# EAGLE board axiom_beta_main_board_v0.37_r1.2 (EAGLE 7.7.0), part 1 of 4
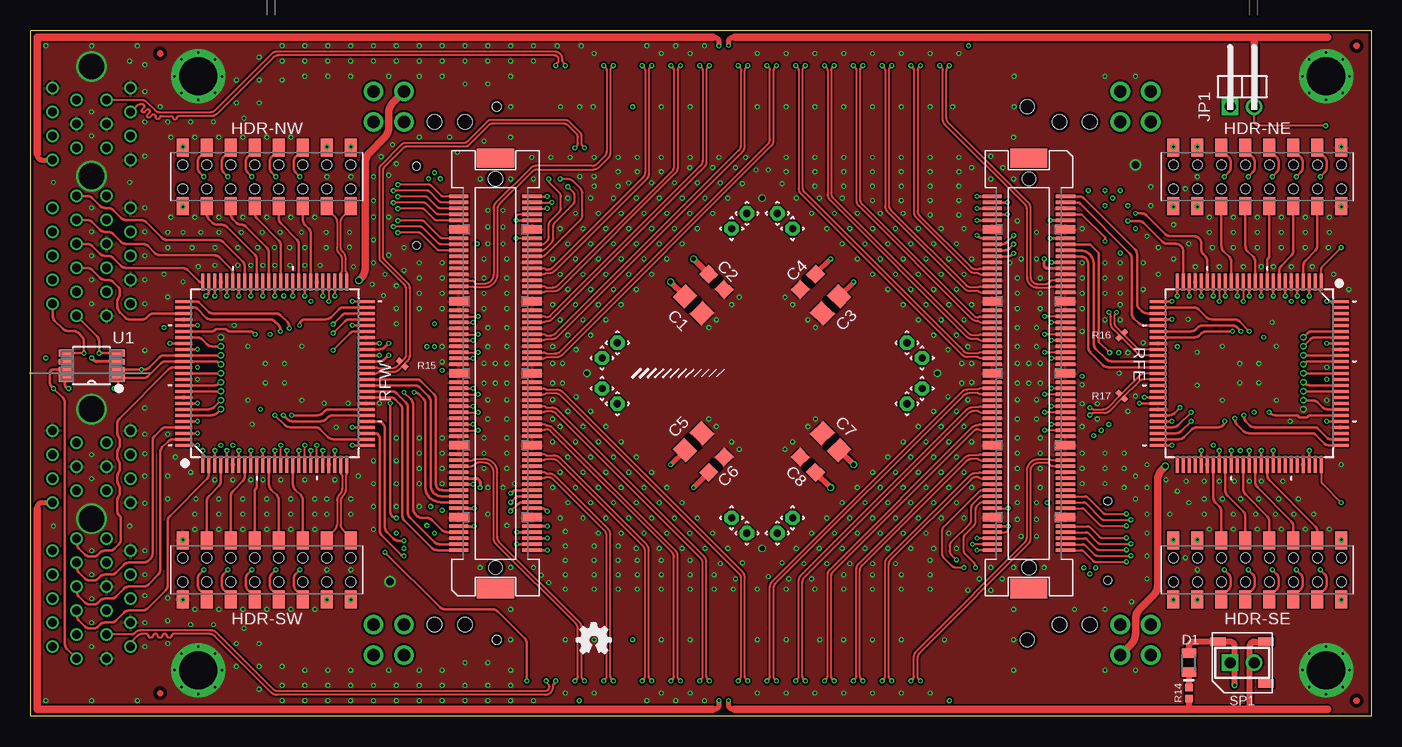
[diagram p6: board, top side]
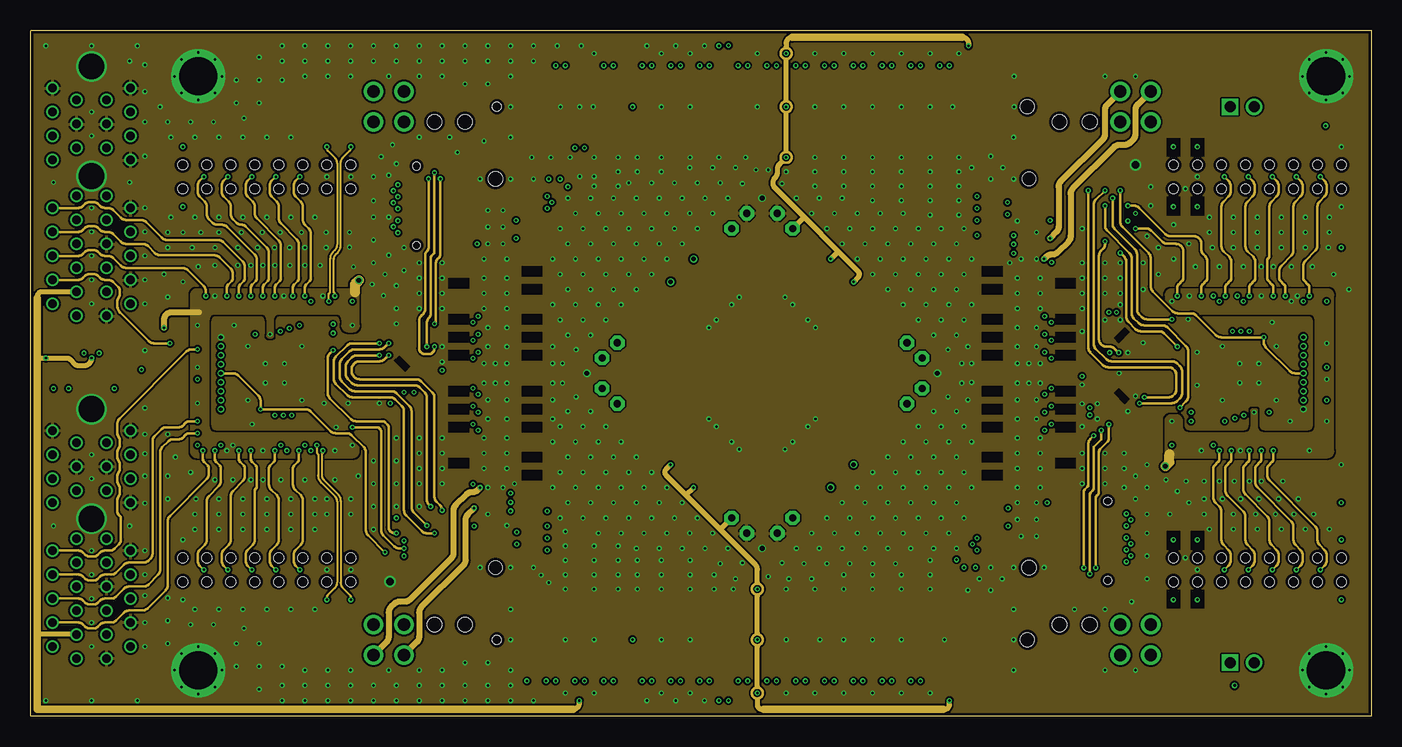
[diagram p7: board, inner layer Route2]
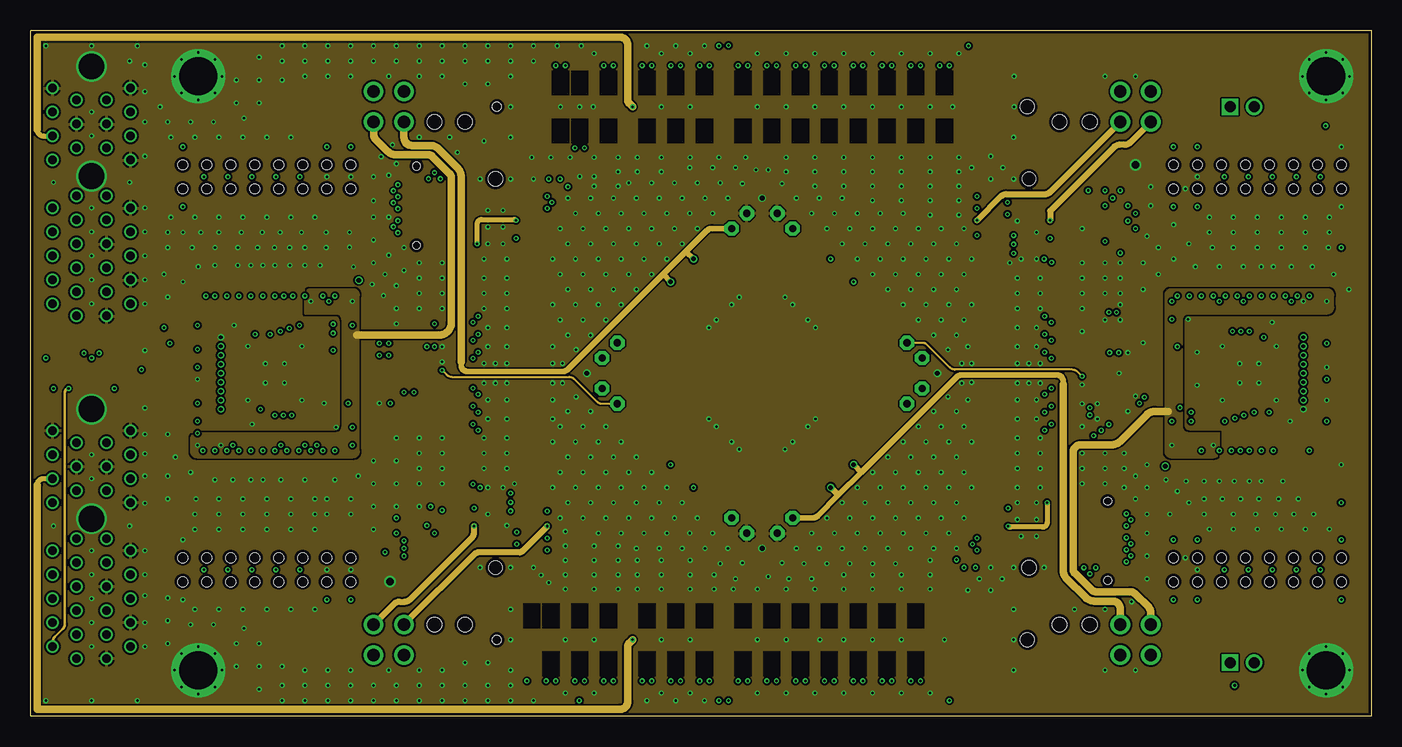
[diagram p8: board, inner layer Route15]
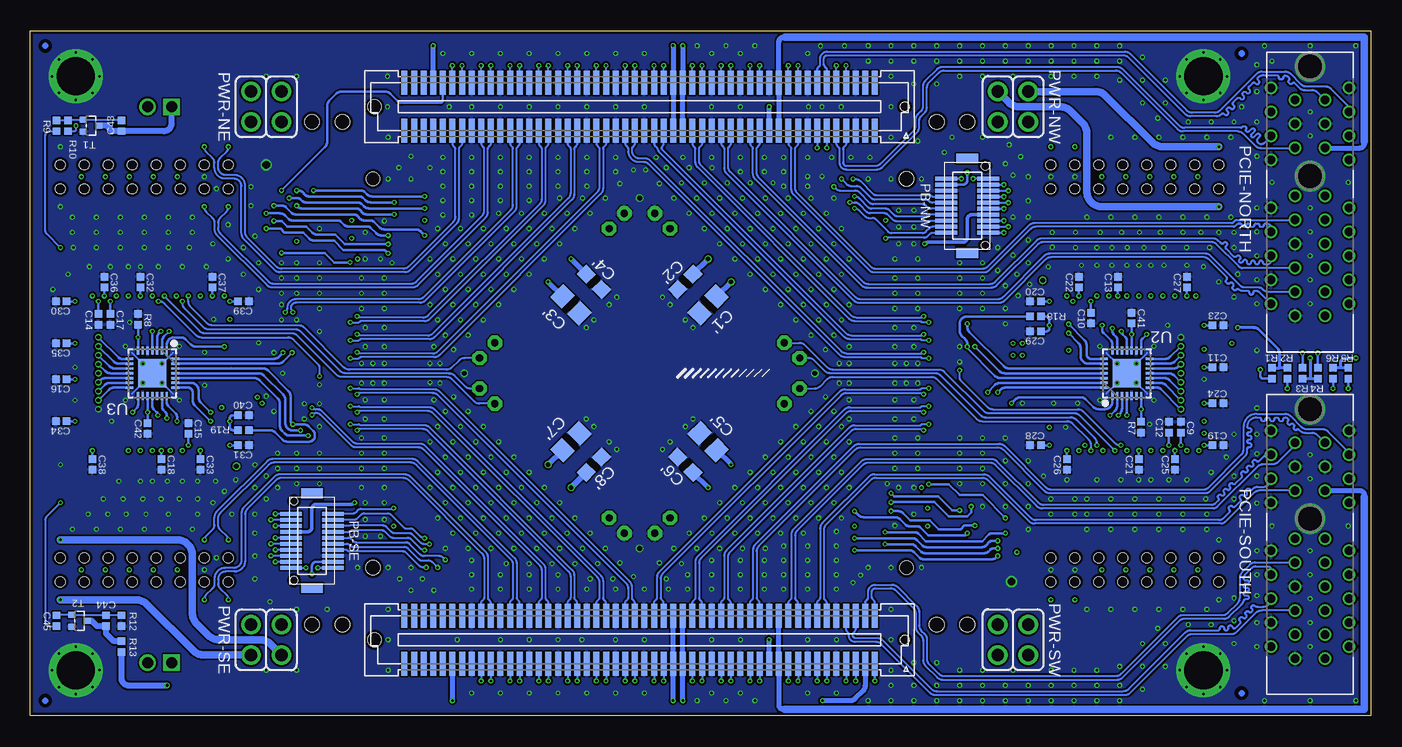
[diagram p9: board, bottom side, seen from below]

Size 111.76 x 57.15 mm. Coordinates in mm from the lower left corner, seen from the top.
Outline: 111.76,57.15 0,57.15 0,0 111.76,0 111.76,57.15
Copper layers (1*2*15*16): Top 0.035559375mm / dielectric 0.17018125mm / Route2 0.01778125mm / dielectric 47mil / Route15 0.01778125mm / dielectric 0.17018125mm / Bottom 0.035559375mm
Design rules "OSHPark-4layer-tuned *": minimum track width 5mil, minimum drill 8mil, track to track 6mil, track to pad 5mil, pad to pad 5mil, via to via 5mil, smd to smd 5mil, copper to edge 10mil, drill to drill 6mil, minimum pad ring 4mil, minimum via ring 4mil, stop-mask expansion 2mil, vias tented up to drill 100mil, thermal gap 6mil
Net classes: 0 default: width 0.152 mm, drill 0.203 mm; 1 LVDS: width 0.152 mm, drill 0.203 mm, clearance 0.152 mm; 2 power: width 0.254 mm, drill 0.254 mm, clearance 0.152 mm
Holes 1.2 mm at 33.66,49.53 36.2,49.53 85.72,49.53 88.27,49.53 33.66,7.62 36.2,7.62 85.72,7.62 88.27,7.62
tKeepout: area 105.4,50.8 to 110.5,55.9; area 105.4,1.3 to 110.5,6.3; area 11.4,1.3 to 16.5,6.3; area 11.4,50.8 to 16.5,55.9; area 44.8,12.4 to 77.1,44.7
bKeepout: area 105.4,50.8 to 110.5,55.9; area 105.4,1.3 to 110.5,6.3; area 11.4,1.3 to 16.5,6.3; area 11.4,50.8 to 16.5,55.9
tRestrict: area 65.9,33.5 to 67.4,35.1; area 54.5,33.5 to 56,35.1; area 54.5,22.1 to 56,23.6; area 65.9,22.1 to 67.4,23.6; area 64.2,20.4 to 65.4,21.6; area 56.5,35.6 to 57.8,36.8; area 64.2,35.6 to 65.4,36.8; area 56.5,20.4 to 57.8,21.6; area 95.8,4.2 to 97.2,4.7
bRestrict: area 65.9,22.1 to 67.4,23.6; area 54.5,33.5 to 56,35.1; area 65.9,33.5 to 67.4,35.1; area 54.5,22.1 to 56,23.6; area 56.5,20.4 to 57.8,21.6; area 64.2,35.6 to 65.4,36.8; area 56.5,35.6 to 57.8,36.8; area 64.2,20.4 to 65.4,21.6

## Footprints (pad centres in the part's own frame; a part is rotated, then mirrored left to right if it is on the bottom)
0805-A = smd 1.35 x 1.55: 1 -1,0; 2 1,0
0603-A = smd 1.15 x 1.1: 1 -0.9,0; 2 0.9,0
0402-B = smd 0.62 x 0.62: 1 -0.45,0; 2 0.45,0
MICROMELF-R = smd 0.8 x 1.2: A 0.8,0; C -0.8,0
62101621821 = smd 1 x 1.5: 1 -7,-2.45; 2 -7,2.45; 3 -5,-2.45; 4 -5,2.45; 5 -3,-2.45; 6 -3,2.45; 7 -1,-2.45; 8 -1,2.45; 9 1,-2.45; 10 1,2.45; 11 3,-2.45; 12 3,2.45; 13 5,-2.45; 14 5,2.45; 15 7,-2.45; 16 7,2.45 | hole 0.8: -5,1; -7,1; -7,-1; -5,-1; -3,1; -3,-1; -1,1; 1,1; 3,1; 5,1; 5,-1; 3,-1; 1,-1; -1,-1; 7,1; 7,-1
1X02M/90-S = drill 0.914 square: 1 -1,0 | drill 0.914: 2 1,0
1X02M = drill 0.914 square: 1 -1,0 | drill 0.914: 2 1,0
61083-FAKE = hole 1.125: -22.1,0 | hole 0.725: 22.1,0
1.2/0.6 = drill 0.6 pad 1.2 octagon: 1 0,0
DF12(XX)-20DP-0.5V = smd 1.8 x 0.35: 1 -1.75,2.25; 2 1.75,2.25; 3 -1.75,1.75; 4 1.75,1.75; 5 -1.75,1.25; 6 1.75,1.25; 7 -1.75,0.75; 8 1.75,0.75; 9 -1.75,0.25; 10 1.75,0.25; 11 -1.75,-0.25; 12 1.75,-0.25; 13 -1.75,-0.75; 14 1.75,-0.75; 15 -1.75,-1.25; 16 1.75,-1.25; 17 -1.75,-1.75; 18 1.75,-1.75; 19 -1.75,-2.25; 20 1.75,-2.25 | smd 1.8 x 0.8: M1 0,3.95; M2 0,-3.95 | hole 0.625: 1.5,-3.3; 1.5,3.3
PCIE-36-NOPEG = drill 0.7: A1 -11.65,1.25; A2 -10.65,3.25; A3 -9.65,1.25; A4 -8.65,3.25; A5 -7.65,1.25; A6 -6.65,3.25; A7 -5.65,1.25; A8 -4.65,3.25; A9 -3.65,1.25; A10 -2.65,3.25; A11 -1.65,1.25; A12 1.35,3.25; A13 2.35,1.25; A14 3.35,3.25; A15 4.35,1.25; A16 5.35,3.25; A17 6.35,1.25; A18 7.35,3.25; B1 -11.65,-1.25; B2 -10.65,-3.25; B3 -9.65,-1.25; B4 -8.65,-3.25; B5 -7.65,-1.25; B6 -6.65,-3.25; B7 -5.65,-1.25; B8 -4.65,-3.25; B9 -3.65,-1.25; B10 -2.65,-3.25; B11 -1.65,-1.25; B12 1.35,-3.25; B13 2.35,-1.25; B14 3.35,-3.25; B15 4.35,-1.25; B16 5.35,-3.25; B17 6.35,-1.25; B18 7.35,-3.25
2X02 = drill 1.016 pad 1.651: 1 -1.27,-1.27; 2 -1.27,1.27; 3 1.27,-1.27; 4 1.27,1.27
0201-B = smd 0.46 x 0.42: 1 -0.33,0; 2 0.33,0
MACHXO2-100TQFP = smd 1.4 x 0.25: 1 -7.6,6; 2 -7.6,5.5; 3 -7.6,5; 4 -7.6,4.5; 5 -7.6,4; 6 -7.6,3.5; 7 -7.6,3; 8 -7.6,2.5; 9 -7.6,2; 10 -7.6,1.5; 11 -7.6,1; 12 -7.6,0.5; 13 -7.6,0; 14 -7.6,-0.5; 15 -7.6,-1; 16 -7.6,-1.5; 17 -7.6,-2; 18 -7.6,-2.5; 19 -7.6,-3; 20 -7.6,-3.5; 21 -7.6,-4; 22 -7.6,-4.5; 23 -7.6,-5; 24 -7.6,-5.5; 25 -7.6,-6; 51 7.6,-6; 52 7.6,-5.5; 53 7.6,-5; 54 7.6,-4.5; 55 7.6,-4; 56 7.6,-3.5; 57 7.6,-3; 58 7.6,-2.5; 59 7.6,-2; 60 7.6,-1.5; 61 7.6,-1; 62 7.6,-0.5; 63 7.6,0; 64 7.6,0.5; 65 7.6,1; 66 7.6,1.5; 67 7.6,2; 68 7.6,2.5; 69 7.6,3; 70 7.6,3.5; 71 7.6,4; 72 7.6,4.5; 73 7.6,5; 74 7.6,5.5; 75 7.6,6 | smd 0.25 x 1.4: 26 -6,-7.6; 27 -5.5,-7.6; 28 -5,-7.6; 29 -4.5,-7.6; 30 -4,-7.6; 31 -3.5,-7.6; 32 -3,-7.6; 33 -2.5,-7.6; 34 -2,-7.6; 35 -1.5,-7.6; 36 -1,-7.6; 37 -0.5,-7.6; 38 0,-7.6; 39 0.5,-7.6; 40 1,-7.6; 41 1.5,-7.6; 42 2,-7.6; 43 2.5,-7.6; 44 3,-7.6; 45 3.5,-7.6; 46 4,-7.6; 47 4.5,-7.6; 48 5,-7.6; 49 5.5,-7.6; 50 6,-7.6; 76 6,7.6; 77 5.5,7.6; 78 5,7.6; 79 4.5,7.6; 80 4,7.6; 81 3.5,7.6; 82 3,7.6; 83 2.5,7.6; 84 2,7.6; 85 1.5,7.6; 86 1,7.6; 87 0.5,7.6; 88 0,7.6; 89 -0.5,7.6; 90 -1,7.6; 91 -1.5,7.6; 92 -2,7.6; 93 -2.5,7.6; 94 -3,7.6; 95 -3.5,7.6; 96 -4,7.6; 97 -4.5,7.6; 98 -5,7.6; 99 -5.5,7.6; 100 -6,7.6
KSSG23J12 = smd 1.3 x 0.7: 1 -2,-1.75; 2 2,-1.75; 3 -2,1.75
SOT416 = smd 0.5 x 0.6: 1 -0.5,-0.65; 2 0.5,-0.65; 3 0,0.65
SOP65P490X300-8N = smd 1.15 x 0.6: 1 -2.175,1.05; 4 -2.175,-1.05; 5 2.175,-1.05; 8 2.175,1.05 | smd 1.15 x 0.45: 2 -2.175,0.325; 3 -2.175,-0.325; 6 2.175,-0.325; 7 2.175,0.325
QFN40P400X400X55-29N = smd 0.65 x 0.2: 1 -1.9,1.2; 2 -1.9,0.8; 3 -1.9,0.4; 4 -1.9,0; 5 -1.9,-0.4; 6 -1.9,-0.8; 7 -1.9,-1.2; 15 1.9,-1.2; 16 1.9,-0.8; 17 1.9,-0.4; 18 1.9,0; 19 1.9,0.4; 20 1.9,0.8; 21 1.9,1.2 | smd 0.2 x 0.65: 8 -1.2,-1.9; 9 -0.8,-1.9; 10 -0.4,-1.9; 11 0,-1.9; 12 0.4,-1.9; 13 0.8,-1.9; 14 1.2,-1.9; 22 1.2,1.9; 23 0.8,1.9; 24 0.4,1.9; 25 0,1.9; 26 -0.4,1.9; 27 -0.8,1.9; 28 -1.2,1.9 | smd 2.35 x 2.35: 29 0,0
FX10A-100S/10 = smd 0.3 x 1.6: 1 -14.75,3.05; 2 -14.75,-3.05; 3 -14.25,3.05; 4 -14.25,-3.05; 5 -13.75,3.05; 6 -13.75,-3.05; 7 -13.25,3.05; 8 -13.25,-3.05; 9 -12.75,3.05; 10 -12.75,-3.05; 11 -11.25,3.05; 12 -11.25,-3.05; 13 -10.75,3.05; 14 -10.75,-3.05; 15 -10.25,3.05; 16 -10.25,-3.05; 17 -9.75,3.05; 18 -9.75,-3.05; 19 -9.25,3.05; 20 -9.25,-3.05; 21 -8.75,3.05; 22 -8.75,-3.05; 23 -8.25,3.05; 24 -8.25,-3.05; 25 -7.75,3.05; 26 -7.75,-3.05; 27 -7.25,3.05; 28 -7.25,-3.05; 29 -6.75,3.05; 30 -6.75,-3.05; 31 -5.25,3.05; 32 -5.25,-3.05; 33 -4.75,3.05; 34 -4.75,-3.05; 35 -4.25,3.05; 36 -4.25,-3.05; 37 -3.75,3.05; 38 -3.75,-3.05; 39 -3.25,3.05; 40 -3.25,-3.05; 41 -2.75,3.05; 42 -2.75,-3.05; 43 -2.25,3.05; 44 -2.25,-3.05; 45 -1.75,3.05; 46 -1.75,-3.05; 47 -1.25,3.05; 48 -1.25,-3.05; 49 -0.75,3.05; 50 -0.75,-3.05; 51 0.75,3.05; 52 0.75,-3.05; 53 1.25,3.05; 54 1.25,-3.05; 55 1.75,3.05; 56 1.75,-3.05; 57 2.25,3.05; 58 2.25,-3.05; 59 2.75,3.05; 60 2.75,-3.05; 61 3.25,3.05; 62 3.25,-3.05; 63 3.75,3.05; 64 3.75,-3.05; 65 4.25,3.05; 66 4.25,-3.05; 67 4.75,3.05; 68 4.75,-3.05; 69 5.25,3.05; 70 5.25,-3.05; 71 6.75,3.05; 72 6.75,-3.05; 73 7.25,3.05; 74 7.25,-3.05; 75 7.75,3.05; 76 7.75,-3.05; 77 8.25,3.05; 78 8.25,-3.05; 79 8.75,3.05; 80 8.75,-3.05; 81 9.25,3.05; 82 9.25,-3.05; 83 9.75,3.05; 84 9.75,-3.05; 85 10.25,3.05; 86 10.25,-3.05; 87 10.75,3.05; 88 10.75,-3.05; 89 11.25,3.05; 90 11.25,-3.05; 91 12.75,3.05; 92 12.75,-3.05; 93 13.25,3.05; 94 13.25,-3.05; 95 13.75,3.05; 96 13.75,-3.05; 97 14.25,3.05; 98 14.25,-3.05; 99 14.75,3.05; 100 14.75,-3.05 | smd 0.7 x 1.6: G1 -12,3.05; G2 -12,-3.05; G3 -6,3.05; G4 -6,-3.05; G5 0,3.05; G6 0,-3.05; G7 6,3.05; G8 6,-3.05; G9 12,3.05; G10 12,-3.05 | smd 1.6 x 3.1: M1 -17.95,0; M2 17.95,0 | hole 1.1: -16.2,0 | hole 1.2: 16.2,0
µZ-NOHOLES-R = smd 0.5 x 2: 1 19.6,-24.226; 2 19.6,-20.226; 3 18.8,-24.226; 4 18.8,-20.226; 5 18,-24.226; 6 18,-20.226; 7 17.2,-24.226; 8 17.2,-20.226; 9 16.4,-24.226; 10 16.4,-20.226; 11 15.6,-24.226; 12 15.6,-20.226; 13 14.8,-24.226; 14 14.8,-20.226; 15 14,-24.226; 16 14,-20.226; 17 13.2,-24.226; 18 13.2,-20.226; 19 12.4,-24.226; 20 12.4,-20.226; 21 11.6,-24.226; 22 11.6,-20.226; 23 10.8,-24.226; 24 10.8,-20.226; 25 10,-24.226; 26 10,-20.226; 27 9.2,-24.226; 28 9.2,-20.226; 29 8.4,-24.226; 30 8.4,-20.226; 31 7.6,-24.226; 32 7.6,-20.226; 33 6.8,-24.226; 34 6.8,-20.226; 35 6,-24.226; 36 6,-20.226; 37 5.2,-24.226; 38 5.2,-20.226; 39 4.4,-24.226; 40 4.4,-20.226; 41 3.6,-24.226; 42 3.6,-20.226; 43 2.8,-24.226; 44 2.8,-20.226; 45 2,-24.226; 46 2,-20.226; 47 1.2,-24.226; 48 1.2,-20.226; 49 0.4,-24.226; 50 0.4,-20.226; 51 -0.4,-24.226; 52 -0.4,-20.226; 53 -1.2,-24.226; 54 -1.2,-20.226; 55 -2,-24.226; 56 -2,-20.226; 57 -2.8,-24.226; 58 -2.8,-20.226; 59 -3.6,-24.226; 60 -3.6,-20.226; 61 -4.4,-24.226; 62 -4.4,-20.226; 63 -5.2,-24.226; 64 -5.2,-20.226; 65 -6,-24.226; 66 -6,-20.226; 67 -6.8,-24.226; 68 -6.8,-20.226; 69 -7.6,-24.226; 70 -7.6,-20.226; 71 -8.4,-24.226; 72 -8.4,-20.226; 73 -9.2,-24.226; 74 -9.2,-20.226; 75 -10,-24.226; 76 -10,-20.226; 77 -10.8,-24.226; 78 -10.8,-20.226; 79 -11.6,-24.226; 80 -11.6,-20.226; 81 -12.4,-24.226; 82 -12.4,-20.226; 83 -13.2,-24.226; 84 -13.2,-20.226; 85 -14,-24.226; 86 -14,-20.226; 87 -14.8,-24.226; 88 -14.8,-20.226; 89 -15.6,-24.226; 90 -15.6,-20.226; 91 -16.4,-24.226; 92 -16.4,-20.226; 93 -17.2,-24.226; 94 -17.2,-20.226; 95 -18,-24.226; 96 -18,-20.226; 97 -18.8,-24.226; 98 -18.8,-20.226; 99 -19.6,-24.226; 100 -19.6,-20.226; 101 19.6,20.226; 102 19.6,24.226; 103 18.8,20.226; 104 18.8,24.226; 105 18,20.226; 106 18,24.226; 107 17.2,20.226; 108 17.2,24.226; 109 16.4,20.226; 110 16.4,24.226; 111 15.6,20.226; 112 15.6,24.226; 113 14.8,20.226; 114 14.8,24.226; 115 14,20.226; 116 14,24.226; 117 13.2,20.226; 118 13.2,24.226; 119 12.4,20.226; 120 12.4,24.226; 121 11.6,20.226; 122 11.6,24.226; 123 10.8,20.226; 124 10.8,24.226; 125 10,20.226; 126 10,24.226; 127 9.2,20.226; 128 9.2,24.226; 129 8.4,20.226; 130 8.4,24.226; 131 7.6,20.226; 132 7.6,24.226; 133 6.8,20.226; 134 6.8,24.226; 135 6,20.226; 136 6,24.226; 137 5.2,20.226; 138 5.2,24.226; 139 4.4,20.226; 140 4.4,24.226; 141 3.6,20.226; 142 3.6,24.226; 143 2.8,20.226; 144 2.8,24.226; 145 2,20.226; 146 2,24.226; 147 1.2,20.226; 148 1.2,24.226; 149 0.4,20.226; 150 0.4,24.226; 151 -0.4,20.226; 152 -0.4,24.226; 153 -1.2,20.226; 154 -1.2,24.226; 155 -2,20.226; 156 -2,24.226; 157 -2.8,20.226; 158 -2.8,24.226; 159 -3.6,20.226; 160 -3.6,24.226; 161 -4.4,20.226; 162 -4.4,24.226; 163 -5.2,20.226; 164 -5.2,24.226; 165 -6,20.226; 166 -6,24.226; 167 -6.8,20.226; 168 -6.8,24.226; 169 -7.6,20.226; 170 -7.6,24.226; 171 -8.4,20.226; 172 -8.4,24.226; 173 -9.2,20.226; 174 -9.2,24.226; 175 -10,20.226; 176 -10,24.226; 177 -10.8,20.226; 178 -10.8,24.226; 179 -11.6,20.226; 180 -11.6,24.226; 181 -12.4,20.226; 182 -12.4,24.226; 183 -13.2,20.226; 184 -13.2,24.226; 185 -14,20.226; 186 -14,24.226; 187 -14.8,20.226; 188 -14.8,24.226; 189 -15.6,20.226; 190 -15.6,24.226; 191 -16.4,20.226; 192 -16.4,24.226; 193 -17.2,20.226; 194 -17.2,24.226; 195 -18,20.226; 196 -18,24.226; 197 -18.8,20.226; 198 -18.8,24.226; 199 -19.6,20.226; 200 -19.6,24.226 | hole 1.125: 22.1,-22.225; 22.1,22.225 | hole 0.725: -22.1,-22.225; -22.1,22.225

## Placement (x,y rotation side)
C1  [0805-A]  55.25,34.29 315 top
C1'  [0805-A]  55.25,34.29 225 bottom
C2  [0603-A]  57.15,36.2 315 top
C2'  [0603-A]  57.15,36.2 225 bottom
C3  [0805-A]  66.67,34.29 225 top
C3'  [0805-A]  66.67,34.29 315 bottom
C4  [0603-A]  64.77,36.2 225 top
C4'  [0603-A]  64.77,36.2 315 bottom
C5  [0805-A]  55.25,22.86 45 top
C5'  [0805-A]  55.25,22.86 135 bottom
C6  [0603-A]  57.15,20.95 45 top
C6'  [0603-A]  57.15,20.95 135 bottom
C7  [0805-A]  66.67,22.86 135 top
C7'  [0805-A]  66.67,22.86 45 bottom
C8  [0603-A]  64.77,20.95 135 top
C8'  [0603-A]  64.77,20.95 45 bottom
C9  100n  [0402-B]  15.86,24.07 90 bottom
C10  100n  [0402-B]  23.36,33.17 270 bottom
C11  100n  [0402-B]  12.76,29.07 0 bottom
C12  100n  [0402-B]  16.86,24.07 90 bottom
C13  100n  [0402-B]  21.11,36.17 90 bottom
C14  100n  [0402-B]  106.06,33.08 270 bottom
C15  100n  [0402-B]  98.56,23.98 90 bottom
C16  100n  [0402-B]  109.16,28.07 180 bottom
C17  100n  [0402-B]  105.06,33.08 270 bottom
C18  100n  [0402-B]  100.81,20.98 270 bottom
C19  10n  [0402-B]  12.76,22.57 0 bottom
C20  10n  [0402-B]  27.96,34.58 180 bottom
C21  10n  [0402-B]  19.36,20.98 270 bottom
C22  10n  [0402-B]  24.36,36.17 90 bottom
C23  10n  [0402-B]  12.76,32.58 0 bottom
C24  10n  [0402-B]  12.76,26.07 0 bottom
C25  10n  [0402-B]  16.36,20.98 270 bottom
C26  10n  [0402-B]  25.36,20.98 270 bottom
C27  10n  [0402-B]  15.36,36.17 90 bottom
C28  10n  [0402-B]  27.96,22.57 180 bottom
C29  10n  [0402-B]  27.96,32.08 180 bottom
C30  10n  [0402-B]  109.16,34.58 180 bottom
C31  10n  [0402-B]  93.96,22.57 0 bottom
C32  10n  [0402-B]  102.56,36.17 90 bottom
C33  10n  [0402-B]  97.56,20.98 270 bottom
C34  10n  [0402-B]  109.16,24.57 180 bottom
C35  10n  [0402-B]  109.16,31.07 180 bottom
C36  10n  [0402-B]  105.56,36.17 90 bottom
C37  10n  [0402-B]  96.56,36.17 90 bottom
C38  10n  [0402-B]  106.56,20.98 270 bottom
C39  10n  [0402-B]  93.96,34.58 0 bottom
C40  10n  [0402-B]  93.96,25.07 0 bottom
C41  100n  [0402-B]  19.96,33.17 90 bottom
C42  100n  [0402-B]  101.96,23.98 270 bottom
C43  10n  [0402-B]  104.14,49.21 270 bottom
C44  10n  [0402-B]  105.41,7.94 270 bottom
C45  1u  [0402-B]  109.54,7.94 270 bottom
D1  DB2S20500L  [MICROMELF-R]  96.52,4.45 90 top
FID1  FIDUCIAL  [FID_ARROW]  10.8,55.25 0 top
FID2  FIDUCIAL  [FID_ARROW]  110.49,55.88 0 top
FID3  FIDUCIAL  [FID_ARROW]  110.49,1.27 0 top
FID4  FIDUCIAL  [FID_ARROW]  10.8,1.9 0 top
FID5  FIDUCIAL  [FID_ARROW]  10.8,55.25 0 bottom
FID6  FIDUCIAL  [FID_ARROW]  110.49,55.88 0 bottom
FID7  FIDUCIAL  [FID_ARROW]  110.49,1.27 0 bottom
FID8  FIDUCIAL  [FID_ARROW]  10.8,1.9 0 bottom
HDR-NE  [62101621821]  102.23,44.96 180 top
HDR-NW  [62101621821]  19.69,44.96 0 top
HDR-SE  [62101621821]  102.23,12.19 180 top
HDR-SW  [62101621821]  19.69,12.19 0 top
JP1  [1X02M/90-S]  100.97,50.8 0 top
JP2  [1X02M]  100.96,4.45 0 top
JX1  BERGSTAK-61083F  [61083-FAKE]  60.96,50.8 0 bottom
JX2  BERGSTAK-61083F  [61083-FAKE]  60.96,6.35 0 bottom
LOGO1  OSHW_LOGO_FILLX0100-NT  [OSHW_FILLX100_NOTEXT]  45.52,5.21 0 top
PAD1  PINPAD1.27MM  [1.2/0.6]  62.23,41.91 45 top
PAD2  PINPAD1.27MM  [1.2/0.6]  63.5,40.64 45 top
PAD3  PINPAD1.27MM  [1.2/0.6]  73.03,31.11 45 top
PAD4  PINPAD1.27MM  [1.2/0.6]  74.3,29.84 45 top
PAD5  PINPAD1.27MM  [1.2/0.6]  74.3,27.3 45 top
PAD6  PINPAD1.27MM  [1.2/0.6]  73.03,26.04 45 top
PAD7  PINPAD1.27MM  [1.2/0.6]  63.5,16.51 45 top
PAD8  PINPAD1.27MM  [1.2/0.6]  62.23,15.24 45 top
PAD9  PINPAD1.27MM  [1.2/0.6]  59.69,15.24 45 top
PAD10  PINPAD1.27MM  [1.2/0.6]  58.42,16.51 45 top
PAD11  PINPAD1.27MM  [1.2/0.6]  48.9,26.04 225 top
PAD12  PINPAD1.27MM  [1.2/0.6]  47.62,27.3 45 top
PAD13  PINPAD1.27MM  [1.2/0.6]  47.62,29.84 45 top
PAD14  PINPAD1.27MM  [1.2/0.6]  48.9,31.11 45 top
PAD15  PINPAD1.27MM  [1.2/0.6]  58.42,40.64 45 top
PAD16  PINPAD1.27MM  [1.2/0.6]  59.69,41.91 45 top
PB-NW  DF12(XX)-20DP-0.5V  [DF12(XX)-20DP-0.5V]  33.66,42.55 0 bottom
PB-SE  DF12(XX)-20DP-0.5V  [DF12(XX)-20DP-0.5V]  88.27,14.6 180 bottom
PCIE-NORTH  PCIE-36-AXIOM-NOPEG  [PCIE-36-NOPEG]  5.08,45.01 90 bottom
PCIE-SOUTH  PCIE-36-AXIOM-NOPEG  [PCIE-36-NOPEG]  5.08,16.44 90 bottom
PWR-NE  PINHD-2X02_2.54  [2X02]  92.08,50.8 180 bottom
PWR-NW  PINHD-2X02_2.54  [2X02]  29.85,50.8 0 bottom
PWR-SE  PINHD-2X02_2.54  [2X02]  92.08,6.35 180 bottom
PWR-SW  PINHD-2X02_2.54  [2X02]  29.85,6.35 0 bottom
R1  4k7  [0402-B]  8.26,28.57 270 bottom
R2  4k7  [0402-B]  6.98,28.57 270 bottom
R3  4k7  [0402-B]  5.72,28.57 90 bottom
R4  4k7  [0402-B]  4.45,28.57 90 bottom
R5  4k7  [0402-B]  1.91,28.57 270 bottom
R6  4k7  [0402-B]  3.18,28.57 270 bottom
R7  50R  [0402-B]  19.16,24.07 270 bottom
R8  50R  [0402-B]  102.76,33.08 90 bottom
R9  10k  [0402-B]  109.53,49.21 90 bottom
R10  200k  [0402-B]  108.59,49.21 90 bottom
R12  10k  [0402-B]  104.14,7.94 90 bottom
R13  12R4  [0402-B]  104.14,5.78 270 bottom
R14  12R4  [0402-B]  96.52,1.9 270 top
R15  100R  [0201-B]  30.96,29.37 315 top
R16  100R  [0201-B]  90.93,31.75 225 top
R17  100R  [0201-B]  90.93,26.67 315 top
R18  10k  [0402-B]  27.96,33.33 180 bottom
R19  10k  [0402-B]  93.96,23.82 0 bottom
RFE  MACHXO2-100  [MACHXO2-100TQFP]  101.56,28.57 270 top
RFW  MACHXO2-100  [MACHXO2-100TQFP]  20.36,28.57 90 top
SP1  KSSG23J12  [KSSG23J12]  100.97,4.45 180 top
T1  NX3008NBKT  [SOT416]  106.68,49.21 270 bottom
T2  NX3008NBKT  [SOT416]  107.63,7.94 270 bottom
U1  PCA9540BDP  [SOP65P490X300-8N]  5.08,29.21 180 top
U2  PIC16F1718-I/MV  [QFN40P400X400X55-29N]  20.36,28.57 90 bottom
U3  PIC16F1718-I/MV  [QFN40P400X400X55-29N]  101.56,28.57 270 bottom
X-EAST  FX10-100/10S  [FX10A-100S/10]  83.19,28.57 270 top
X-WEST  FX10-100/10S  [FX10A-100S/10]  38.73,28.57 90 top
ZED1  µZ-FCI-NOHOLES-R  [µZ-NOHOLES-R]  60.96,28.57 180 bottom

## Tracks (layer width: path | path; a pad name or v marks a point on that pad's centre or on a via)
!E_RESET!  (via drill 0.2)
  Top 0.203: X-EAST.19 v85.09,37.83
  Route2 0.203: v90.81,38.61 91.13,38.29 arc-45 91.31,37.84 91.31,33.28 arc45 91.5,32.83 92.07,32.26 arc45 92.52,32.08 94.03,32.08 arc-45 94.48,31.89 v95.57,30.8
  Bottom 0.203: v85.09,37.83 86.41,37.83 87.19,38.61 v90.81,38.61 | U3.1 100.36,30.94 arc90 99.72,31.57 99.22,31.57 arc45 98.77,31.39 98.37,30.98 arc-45 97.92,30.8 v95.57,30.8
!SS!_E  (via drill 0.2)
  Top 0.203: RFE.27 96.9,34.08 arc-45 97.35,33.89 97.97,33.26 arc45 98.42,33.08 100.3,33.08 arc-45 100.75,32.89 v101.56,32.08
  Bottom 0.203: U3.4 v101.56,32.08
!SS!_W  (via drill 0.2)
  Top 0.203: RFW.27 25.22,23.07 arc-45 24.77,23.26 24.15,23.89 arc45 23.7,24.07 21.62,24.07 arc-45 21.17,24.26 v20.36,25.07
  Bottom 0.203: U2.4 v20.36,25.07
!W_RESET!  (via drill 0.2)
  Top 0.203: X-WEST.19 v36.86,19.32 | v30.48,16.51 arc-90 29.97,17.02 v29.97,26.07
  Bottom 0.203: v36.86,19.32 35.2,19.32 34.29,18.41 32.39,18.41 v30.48,16.51 | U2.1 21.56,26.21 arc90 22.2,25.57 22.7,25.57 arc45 23.15,25.76 23.77,26.39 arc-45 24.22,26.57 28.96,26.57 29.2,26.57 arc-45 29.65,26.39 v29.96,26.07 v29.97,26.07
A_!RST  (via drill 0.2)
  Route2 0.203: v33.16,44.8 33.16,39.03 arc-45 33.05,38.76 33.01,38.72 arc45 32.89,38.45 32.89,33.98 arc-45 32.71,33.53 32.57,33.4 arc45 32.39,32.95 32.39,30.67 arc90 32.89,30.16 33.15,30.16 arc90 33.66,30.67 v33.66,30.8
  Bottom 0.152: PB-NW.2 v33.16,44.8
  Bottom 0.203: U2.26 30.9,28.18 arc45 31.35,28.36 33.66,30.67 v33.66,30.8 33.66,30.98 arc-45 33.84,31.43 34.1,31.69 arc45 34.29,32.14 34.29,32.69 arc90 33.66,33.33 R18.2
A_SCL  (via drill 0.2)
  Route2 0.203: v34.15,44.8 34.15,38.5 arc-45 34.04,38.23 33.89,38.09 arc45 33.78,37.81 33.78,33.01 arc-45 v33.66,32.7
  Bottom 0.203: PB-NW.1 v34.15,44.8 | U2.24 30.17,28.97 arc45 30.62,29.16 33.47,32.01 arc45 33.66,32.46 v33.66,32.7
A_SDA  (via drill 0.2)
  Route2 0.203: v33.66,45.3 33.66,38.77 arc-45 33.54,38.5 33.45,38.4 arc45 33.34,38.13 33.34,33.52 arc-45 33.21,33.21 arc45 33.02,32.76 v33.02,30.8
  Bottom 0.203: PB-NW.3 34.04,44.3 arc-90 33.66,44.68 v33.66,45.3 | U2.25 30.53,28.57 arc45 30.98,28.76 v33.02,30.8
B_!RST  (via drill 0.2)
  Route2 0.203: v88.76,12.36 88.76,18.14 arc-45 88.85,18.37 88.93,18.45 arc45 89.03,18.67 89.03,22 arc-45 89.14,22.27 89.74,22.88 arc45 89.85,23.14 v89.85,24.32
  Bottom 0.152: PB-SE.2 v88.76,12.36 | 95,29.02 94.96,28.97
  Bottom 0.203: U3.26 94.96,28.97 92.36,28.97 arc45 91.91,28.79 90.23,27.11 arc45 90.04,26.66 90.04,24.62 arc-45 89.97,24.44 v89.85,24.32 88.97,24.32 arc45 88.52,24.13 88.16,23.77 arc45 88.01,23.41 88.01,23.37 arc90 88.52,22.86 90.29,22.86 arc45 90.74,23.05 91.33,23.64 arc-45 91.78,23.82 R19.2
B_SCL  (via drill 0.2)
  Route2 0.203: v87.77,12.36 87.77,18.68 arc-45 87.86,18.9 88.05,19.08 arc45 88.14,19.31 88.14,22.66 arc-45 88.32,23.11 v88.58,23.37
  Bottom 0.203: v88.58,23.37 90.1,23.37 arc45 90.55,23.55 90.75,23.75 arc45 90.93,24.2 90.93,26.03 arc-45 91.12,26.47 92.63,27.99 arc-45 93.08,28.18 U3.24 | PB-SE.1 v87.77,12.36
B_SDA  (via drill 0.2)
  Route2 0.203: v88.27,11.84 88.27,18.41 arc-45 88.36,18.63 88.49,18.77 arc45 88.58,18.99 88.58,22.41 89.22,23.05 v89.22,23.81
  Bottom 0.203: v89.22,23.81 89.85,23.81 arc90 90.49,24.45 90.49,26.34 arc-45 90.67,26.79 92.27,28.39 arc-45 92.72,28.57 U3.25 | PB-SE.3 87.88,12.85 arc-90 88.27,12.47 v88.27,11.84
BANK13_00_N
  Bottom 0.152: 6.06,52.46 5.98,52.38 arc-45 5.53,52.19 4.92,52.19 arc45 4.47,52 PCIE-NORTH.B17 | 6.06,52.46 arc-63 6.06,52.46 | 6.06,52.46 6.35,52.75 arc-90 6.56,52.75 6.57,52.73 arc90 6.79,52.73 6.85,52.79 arc90 6.85,53.01 6.84,53.02 arc-80 6.88,53.26 arc-45 7.16,53.4 arc-90 7.31,53.25 7.31,53.23 arc90 7.46,53.08 7.56,53.08 arc90 7.71,53.23 7.71,53.27 arc-90 7.86,53.42 8.96,53.42 arc-45 9.41,53.24 arc-90 9.41,53.02 9.36,52.97 arc90 9.36,52.75 9.4,52.72 arc90 9.61,52.72 9.66,52.77 arc-90 9.88,52.77 10.17,52.48 arc-90 10.17,52.26 10.12,52.21 arc90 10.12,51.99 10.16,51.96 arc90 10.37,51.96 10.42,52.01 arc-90 10.64,52.01 10.68,51.97 arc-90 10.68,51.76 10.62,51.7 arc90 10.62,51.49 10.66,51.45 arc90 10.88,51.45 10.93,51.5 arc-90 11.15,51.5 11.49,51.16 arc-90 11.49,50.95 11.43,50.89 arc90 11.43,50.68 11.47,50.64 arc90 11.69,50.64 11.74,50.7 arc-90 11.95,50.7 11.99,50.66 arc-90 11.99,50.44 11.94,50.39 arc90 11.94,50.17 11.98,50.14 arc90 12.19,50.14 12.24,50.19 arc-90 12.46,50.19 12.45,50.2 arc45 12.9,50.01 15.05,50.01 arc45 15.5,50.2 20.2,54.91 arc-45 20.65,55.09 45.32,55.09 arc-90 45.6,54.81 45.6,54.35 arc-45 45.53,54.17 45.43,54.07 arc45 45.36,53.89 ZED1.89
BANK13_00_P
  Bottom 0.152: PCIE-NORTH.B16 1.83,50.52 arc-45 2.02,50.97 3.36,52.31 arc-45 3.8,52.49 5.4,52.49 arc45 5.85,52.68 6.71,53.54 arc-45 7.16,53.73 9.09,53.73 arc-45 9.54,53.54 12.58,50.5 arc45 13.03,50.32 14.92,50.32 arc45 15.37,50.5 20.08,55.21 arc-45 20.53,55.4 45.32,55.4 arc-90 45.91,54.81 45.91,54.35 arc45 45.98,54.17 46.09,54.07 arc-45 46.16,53.89 ZED1.87
BANK13_01_N  (via drill 0.2)
  Top 0.152: v45.36,47.37 45.5,47.51 arc45 45.61,47.78 45.61,48.25 arc45 45.5,48.52 44.75,49.27 arc45 44.48,49.38 38.45,49.38 arc45 38.18,49.27 36.5,47.58 arc-45 36.23,47.47 31.34,47.47 arc45 31.07,47.36 29.47,45.77 arc45 29.36,45.5 29.36,38.32 arc45 29.47,38.05 31.4,36.13 arc-45 31.59,35.68 31.59,30.04 arc-45 31.4,29.6 31.06,29.26 | 31.06,29.26 30.66,28.86 arc-45 30.21,28.67 29.01,28.67 arc45 28.92,28.63 28.9,28.61 arc-45 28.81,28.57 RFW.38 | R15.2 31.06,29.26
  Bottom 0.152: ZED1.90 v45.36,47.37
BANK13_01_P  (via drill 0.2)
  Top 0.152: v46.16,47.37 46.02,47.51 arc-45 45.91,47.78 45.91,48.38 arc45 45.8,48.65 44.88,49.57 arc45 44.61,49.68 38.32,49.68 arc45 38.05,49.57 36.37,47.89 arc-45 36.1,47.78 31.21,47.78 arc45 30.94,47.67 29.17,45.89 arc45 29.06,45.62 29.06,38.2 arc45 29.17,37.92 31.09,36 arc-45 31.28,35.55 31.28,30.17 arc-45 31.09,29.72 30.85,29.48 | 30.85,29.48 30.54,29.16 arc-45 30.09,28.98 29.01,28.98 arc-45 28.92,29.02 28.9,29.04 arc45 28.81,29.07 RFW.39 | R15.1 30.85,29.48
  Bottom 0.152: ZED1.88 v46.16,47.37
BANK13_02_N  (via drill 0.2)
  Top 0.152: v43.76,54.23 arc-45 43.83,54.4 43.93,54.5 arc45 44.01,54.68 44.01,54.71 arc90 43.63,55.09 20.65,55.09 arc45 20.2,54.91 15.5,50.2 arc-45 15.05,50.01 12.31,50.01 arc90 12.19,49.88 12.19,49.88 arc-90 12.04,49.75 11.99,49.75 arc-90 11.87,49.88 11.87,49.88 arc85 11.71,50.01 10.88,50.01 arc85 10.75,49.88 arc-90 10.61,49.77 10.6,49.77 arc-100 10.43,49.94 arc80 10.35,50.13 arc80 10.12,50.1 9.96,49.94 arc-90 9.74,49.94 9.74,49.94 arc-90 9.74,50.15 9.9,50.32 arc90 9.9,50.53 9.9,50.53 arc90 9.69,50.53 9.52,50.37 arc-90 9.31,50.37 9.31,50.37 arc-90 9.31,50.59 9.47,50.75 arc120 9.31,51 9.2,51 arc45 8.79,50.82 PCIE-NORTH.A16
  Bottom 0.152: ZED1.93 v43.76,54.23
BANK13_02_P  (via drill 0.2)
  Top 0.152: v44.56,54.23 arc45 44.49,54.4 44.39,54.5 arc-45 44.31,54.68 44.31,54.76 arc90 43.68,55.4 20.53,55.4 arc45 20.08,55.21 15.37,50.5 arc-45 14.92,50.32 10.81,50.32 arc-45 10.37,50.5 9.69,51.18 arc45 9.24,51.36 PCIE-NORTH.A17
  Bottom 0.152: ZED1.91 v44.56,54.23
BANK13_03_N
  Bottom 0.152: ZED1.94 43.76,47.71 arc45 43.83,47.53 43.93,47.43 arc-45 44,47.25 44,46.15 arc-90 43.72,45.87 41.31,45.87 arc-45 40.86,46.06 38.15,48.77 arc-45 37.97,49.22 37.97,49.71 arc45 37.78,50.16 37.52,50.42 arc-45 37.33,50.87 37.33,52.5 arc45 37.14,52.95 36.16,53.94 arc45 35.71,54.13 21.16,54.13 arc45 20.71,53.94 16.01,49.23 arc-45 15.56,49.05 10.85,49.05 arc-45 10.73,49.12 | PCIE-NORTH.A14 8.91,47.78 arc90 9.43,47.81 arc90 9.46,48.14 9.3,48.3 arc-90 9.3,48.51 9.3,48.52 arc-90 9.52,48.52 9.74,48.29 arc90 9.96,48.29 9.96,48.3 arc90 9.96,48.51 9.74,48.74 arc-90 9.74,48.95 9.74,48.96 arc-90 9.96,48.96 10.17,48.74 arc83 10.38,48.73 arc76 10.41,48.92 arc-35 10.39,49 arc-90 10.55,49.17 10.59,49.17 arc-45 10.73,49.12 | 10.73,49.12
BANK13_03_P
  Bottom 0.152: ZED1.92 44.56,47.71 arc-45 44.49,47.53 44.38,47.43 arc45 44.31,47.25 44.31,46.15 arc-90 43.72,45.57 41.19,45.57 arc-45 40.74,45.75 37.85,48.65 arc-45 37.66,49.09 37.66,49.59 arc45 37.47,50.03 37.21,50.3 arc-45 37.03,50.75 37.03,52.38 arc45 36.84,52.83 36.03,53.64 arc45 35.58,53.82 21.29,53.82 arc45 20.84,53.64 16.13,48.93 arc-45 15.68,48.74 11.11,48.74 arc45 10.66,48.56 9.61,47.51 arc-45 9.16,47.36 PCIE-NORTH.A13
BANK13_04_N
  Bottom 0.152: ZED1.195 42.96,7.28 arc45 43.07,7.01 43.11,6.98 arc-45 43.21,6.73 arc-90 42.95,6.48 41.13,6.48 arc45 40.68,6.29 36.64,2.24 arc-45 36.19,2.06 20.65,2.06 arc-45 20.2,2.24 15.49,6.95 arc45 15.04,7.14 12.76,7.14 arc-90 12.61,7.29 12.61,7.33 arc90 12.45,7.48 12.41,7.48 arc90 12.26,7.33 12.26,7.29 arc-90 12.1,7.14 12.06,7.14 arc-90 11.9,7.29 11.9,7.4 arc90 11.75,7.56 11.7,7.56 arc70 11.55,7.4 11.53,7.37 11.5,7.34 arc-90 11.29,7.34 10.92,7.71 arc-90 10.92,7.92 10.94,7.93 arc45 10.94,7.93 arc90 10.94,8.17 10.9,8.21 arc90 10.69,8.21 10.66,8.18 arc-90 10.45,8.18 10.42,8.21 arc-90 10.42,8.43 10.44,8.45 arc90 10.44,8.67 10.41,8.7 arc90 10.19,8.7 10.17,8.68 arc-90 9.95,8.68 9.92,8.71 arc-90 9.92,8.93 9.95,8.95 arc90 9.95,9.16 9.91,9.2 arc90 9.7,9.2 arc-45 9.43,9.11 9.01,9.11 arc-90 PCIE-SOUTH.A6
BANK13_04_P
  Bottom 0.152: PCIE-SOUTH.A5 9.11,8.79 arc-45 9.56,8.64 11.18,7.02 arc45 11.63,6.83 14.91,6.83 arc-45 15.36,6.65 20.07,1.94 arc45 20.52,1.75 36.31,1.75 arc45 36.76,1.94 40.81,5.99 arc-45 41.26,6.17 43,6.17 arc90 43.51,6.68 43.51,6.72 arc-45 43.62,6.99 43.65,7.01 arc45 43.76,7.28 ZED1.193
BANK13_05_N  (via drill 0.2)
  Top 0.152: v42.96,2.92 arc45 43.03,2.75 43.13,2.65 arc-45 43.21,2.47 43.21,2.44 arc-90 42.83,2.06 20.65,2.06 arc-45 20.2,2.24 15.49,6.95 arc45 15.04,7.14 9.16,7.14 arc45 8.71,6.95 arc-45 8.4,6.79 PCIE-SOUTH.A3
  Bottom 0.152: ZED1.196 v42.96,2.92
BANK13_05_P  (via drill 0.2)
  Top 0.152: v43.76,2.92 arc-45 43.69,2.75 43.59,2.65 arc45 43.51,2.47 43.51,2.39 arc-90 42.88,1.75 20.52,1.75 arc-45 20.07,1.94 15.36,6.65 arc45 14.91,6.83 11.9,6.83 arc90 11.74,6.68 11.74,6.68 arc-90 11.59,6.52 11.51,6.52 arc-90 11.36,6.68 11.36,6.68 arc90 11.2,6.83 11.12,6.83 arc90 10.97,6.68 10.97,6.68 arc-90 10.82,6.52 10.74,6.52 arc-90 10.59,6.68 10.59,6.68 arc90 10.43,6.83 10.35,6.83 arc90 10.2,6.68 10.2,6.68 arc-90 10.05,6.52 9.97,6.52 arc-90 9.81,6.68 9.81,6.68 arc90 9.66,6.83 9.29,6.83 arc45 8.89,6.67 8.52,6.29 arc45 8.33,5.84 PCIE-SOUTH.A2
  Bottom 0.152: ZED1.194 v43.76,2.92
BANK13_06_N
  Bottom 0.152: ZED1.199 41.36,9.44 arc-45 41.43,9.62 41.53,9.72 arc45 41.6,9.9 41.6,10.36 arc90 41.32,10.64 40.04,10.64 arc45 39.59,10.46 38.15,9.01 arc45 37.97,8.56 37.97,7.44 arc-45 37.78,6.99 37.52,6.73 arc45 37.33,6.28 37.33,4.64 arc-45 37.14,4.2 36.16,3.21 arc-45 35.71,3.02 21.16,3.02 arc-45 20.71,3.21 16,7.92 arc45 15.55,8.1 12.27,8.1 arc-45 11.82,8.29 10.83,9.28 arc-30 10.64,9.57 arc60 10.49,9.72 10.34,9.72 arc-90 10.18,9.88 10.18,9.89 arc-90 10.34,10.04 10.49,10.04 arc90 10.64,10.2 10.64,10.21 arc90 10.49,10.36 10.34,10.36 arc-90 10.18,10.52 10.18,10.53 arc-90 10.34,10.69 10.49,10.69 arc90 10.64,10.84 10.64,10.85 arc90 10.49,11 10.34,11 arc-90 10.18,11.15 10.18,11.17 arc-90 10.34,11.32 10.49,11.32 arc90 10.64,11.47 arc45 10.49,11.79 9.98,12.31 arc45 9.62,12.46 8.58,12.46 arc90 8.33,12.21 PCIE-SOUTH.A8
BANK13_06_P
  Bottom 0.152: ZED1.197 42.16,9.44 arc45 42.09,9.62 41.98,9.72 arc-45 41.91,9.9 41.91,10.36 arc90 41.32,10.95 39.92,10.95 arc45 39.47,10.76 37.85,9.14 arc45 37.66,8.69 37.66,7.56 arc-45 37.47,7.12 37.21,6.85 arc45 37.03,6.4 37.03,4.77 arc-45 36.84,4.32 36.03,3.51 arc-45 35.58,3.33 21.28,3.33 arc-45 20.83,3.51 16.12,8.22 arc45 15.68,8.41 12.39,8.41 arc-45 11.94,8.59 11.13,9.4 arc-45 10.95,9.85 10.95,11.51 arc45 10.76,11.96 10.12,12.6 arc45 9.67,12.79 PCIE-SOUTH.A9
BANK13_SE_0  (via drill 0.2, 0.33)
  Top 0.203: RFW.88 v15.86,28.57 | v29.53,13.65 34.1,9.08 arc45 34.55,8.89 38.47,8.89 arc-45 38.92,8.7 41.17,6.45 arc-45 41.36,6 v41.36,2.92
  Route2 0.203: v29.53,13.65 28.13,15.05 arc-45 27.94,15.5 27.94,21.96 arc45 27.75,22.41 26.78,23.39 arc45 26.33,23.57 25.42,23.57 arc-45 24.97,23.76 23.35,25.39 arc45 22.9,25.57 v19.16,25.57 19.16,26.26 arc45 18.97,26.71 17.3,28.39 arc45 16.85,28.57 v15.86,28.57
  Bottom 0.203: ZED1.200 v41.36,2.92 | R7.1 v19.16,25.57 U2.7
C_CK_E  (via drill 0.2)
  Top 0.152: RFE.18 v99.06,34.58
  Bottom 0.152: 99.06,34.43 arc-45 98.87,33.98 97.33,32.44 arc-45 96.88,32.25 89.66,32.25 arc45 89.21,32.06 85.91,28.76 arc-45 85.46,28.57 76.84,28.57 arc45 76.39,28.39 75.5,27.49 arc-45 75.05,27.3 PAD5.1
  Bottom 0.203: 99.06,34.43 v99.06,34.58
C_CK_W  (via drill 0.2)
  Top 0.152: RFW.18 v22.86,22.57
  Bottom 0.152: 22.86,22.72 arc-45 23.05,23.17 24.59,24.71 arc-45 25.04,24.9 32.12,24.9 arc45 32.57,25.09 35.87,28.39 arc-45 36.32,28.57 45.08,28.57 arc45 45.52,28.76 46.42,29.66 arc-45 46.87,29.84 PAD13.1
  Bottom 0.203: 22.86,22.72 v22.86,22.57
C_EN_E  (via drill 0.2)
  Top 0.152: RFE.14 v101.06,34.58
  Route15 0.152: PAD3.1 74.29,31.11 arc-45 74.73,30.93 76.6,29.07 arc45 77.05,28.88 86.81,28.88 arc-45 87.26,28.69 v87.63,28.32
  Bottom 0.152: v101.06,34.58 101,34.58 arc45 100.56,34.39 97.93,31.76 arc-45 97.48,31.57 90.26,31.57 arc45 89.81,31.39 87.74,29.32 arc45 87.63,29.05 v87.63,28.32
C_EN_W  (via drill 0.2)
  Top 0.152: RFW.14 v20.86,22.57
  Route15 0.152: PAD11.1 47.63,26.04 arc-45 47.19,26.22 45.32,28.08 arc45 44.87,28.27 35.11,28.27 arc-45 34.66,28.46 v34.29,28.83
  Bottom 0.152: v20.86,22.57 20.91,22.57 arc45 21.36,22.76 23.99,25.39 arc-45 24.44,25.57 31.53,25.57 arc45 31.98,25.76 34.18,27.96 arc45 34.29,28.23 v34.29,28.83
C_SI_E  (via drill 0.2)
  Top 0.152: RFE.19 v98.56,35.02
  Bottom 0.152: PAD4.1 75.56,29.84 arc-45 76,29.66 76.6,29.07 arc45 77.05,28.88 85.14,28.88 arc45 85.59,29.07 88.92,32.39 arc-45 89.37,32.58 96.57,32.58 arc45 97.02,32.76 98.37,34.11 arc45 98.56,34.56 v98.56,35.02
C_SI_W  (via drill 0.2)
  Top 0.152: RFW.19 v23.36,22.12
  Bottom 0.152: PAD12.1 46.36,27.3 arc-45 45.91,27.49 45.32,28.08 arc45 44.87,28.27 36.64,28.27 arc45 36.19,28.08 32.87,24.76 arc-45 32.42,24.57 25.35,24.57 arc45 24.9,24.39 23.55,23.04 arc45 23.36,22.59 v23.36,22.12
C_SO_E  (via drill 0.2)
  Top 0.152: RFE.15 v100.56,35.02
  Bottom 0.152: PAD6.1 74.29,26.04 arc45 74.73,26.22 76.6,28.08 arc-45 77.05,28.27 85.78,28.27 arc45 86.23,28.46 89.49,31.71 arc-45 89.94,31.9 97.17,31.9 arc45 97.62,32.09 v100.56,35.02
C_SO_W  (via drill 0.2)
  Top 0.152: RFW.15 v21.36,22.12
  Bottom 0.152: PAD14.1 47.63,31.11 arc45 47.19,30.93 45.32,29.07 arc-45 44.87,28.88 36.01,28.88 arc45 35.56,28.69 32.3,25.44 arc-45 31.85,25.25 24.75,25.25 arc45 24.3,25.06 v21.36,22.12
CSO_NE_V  (via drill 0.2)
  Top 0.406: v66.67,38.1 C4.1 | v68.58,36.2 arc-63 v68.58,36.2 | C3'.1 v68.58,36.2
  Route2 0.152: 62.96,46.12 arc30 62.56,46.18
  Route2 0.203: 62.96,47.03 arc-180 62.96,46.12 arc-180 62.96,47.03 | 62.96,50.34 arc180 62.96,51.26 | 62.96,51.26 arc180 62.96,50.34 | 62.96,54.79 arc180 62.96,55.7 | 62.96,55.7 arc180 62.96,54.79 | 62.96,47.03 62.96,47.13 | 62.96,50.24 62.96,50.34 | 62.96,51.26 62.96,51.36 | 62.96,54.79 62.96,54.69 | 62.96,55.7 62.96,55.8
  Route2 0.406: 62.96,51.36 62.96,54.69 | 62.96,47.13 62.96,50.24 | 62.56,46.18 62.42,46.03 arc45 62.23,45.58 62.23,45.35 arc-45 62.04,44.9 arc90 62.04,44 64.45,41.59 | 64.45,41.59 67.31,38.73 | 67.31,38.73 68.95,37.1 arc-90 68.95,36.56 v68.58,36.2 | 67.31,38.73 v66.67,38.1 | PAD2.1 64.45,41.59 | 63.47,56.59 arc90 62.96,56.08 62.96,55.8 | 77.65,56.59 arc-90 78.16,56.08 v78.16,55.88
  Route2 0.61: 77.65,56.59 63.47,56.59
  Bottom 0.406: v66.67,38.1 arc-63 v66.67,38.1 | v66.67,38.1 C4.1 | v68.58,36.2 arc-63 v68.58,36.2 | v68.58,36.2 C3'.1 | ZED1.7 v78.16,55.88
CSO_NW_V  (via drill 0.38)
  Top 0.508: C1.1 v53.34,36.2 | C2.1 v55.25,38.1
  Route15 0.457: 52.7,36.83 44.79,28.91 arc-45 44.34,28.73 36.39,28.73 arc-90 35.88,29.23 35.88,29.53 | 54.61,38.73 56.33,40.45 arc-45 56.78,40.64 PAD15.1 | v53.34,36.2 52.7,36.83 | v55.25,38.1 54.61,38.73 | 54.61,38.73 52.7,36.83
  Route15 0.61: 35.88,29.53 35.88,44.98 arc45 35.58,45.7 34,47.28 arc45 33.28,47.57 31.75,47.57 arc-90 31.12,48.21 PWR-NW.1
  Bottom 0.203: v53.34,36.2
  Bottom 0.457: C1.1 v53.34,36.2 | C2.1 v55.25,38.1
  Bottom 0.508: v55.25,38.1
CSO_SE_V  (via drill 0.38)
  Top 0.508: v66.67,19.05 C8'.1 | v68.58,20.95 C7'.1
  Route15 0.457: 69.22,20.32 77.13,28.24 arc-45 77.58,28.42 85.53,28.42 arc-90 86.04,27.91 86.04,27.62 | PAD7.1 65.14,16.51 arc45 65.59,16.7 67.31,18.41 | v66.67,19.05 67.31,18.41 | v68.58,20.95 69.22,20.32 | 67.31,18.41 69.22,20.32
  Route15 0.61: 86.04,27.62 86.04,12.17 arc45 86.34,11.45 87.92,9.87 arc45 88.64,9.58 90.17,9.58 arc-90 90.81,8.94 PWR-SE.1
  Bottom 0.203: v66.67,19.05
  Bottom 0.457: v66.67,19.05 C8'.1 | v68.58,20.95 C7'.1
CSO_SW_V  (via drill 0.2)
  Top 0.406: v55.25,19.05 C6.1 | v53.34,20.95 C5'.1
  Route2 0.203: 60.56,1.35 60.56,1.45 | 60.56,1.45 arc180 60.56,2.36 | 60.56,2.36 60.56,2.46 | 60.56,2.36 arc180 60.56,1.45 | 60.56,5.89 arc180 60.56,6.81 | 60.56,6.81 arc180 60.56,5.89 | 60.56,10.12 arc180 60.56,11.03 | 60.56,11.03 arc180 60.56,10.12 | 60.56,5.79 60.56,5.89 | 60.56,6.81 60.56,6.91 | 60.56,10.01 60.56,10.12 | 60.56,11.03 60.56,11.14
  Route2 0.406: 60.56,2.46 60.56,5.79 | 60.56,6.91 60.56,10.01 | 60.56,11.14 60.56,12.19 arc44 60.38,12.63 59.87,13.15 arc45 59.87,13.16 57.47,15.56 | 57.47,15.56 54.61,18.41 | 54.61,18.41 52.97,20.05 arc-90 52.97,20.59 v53.34,20.95 | 54.61,18.41 v55.25,19.05 | PAD10.1 57.47,15.56 | 60.56,1.35 60.56,0.94 arc90 60.94,0.56 61.11,0.56 | 76.05,0.56 76.18,0.56 arc90 76.56,0.94 v76.56,1.27
  Route2 0.61: 76.05,0.56 61.11,0.56
  Bottom 0.406: v53.34,20.95 C5'.1 | C6.1 v55.25,19.05 | ZED1.112 v76.56,1.27
DONE_E  (via drill 0.2)
  Top 0.203: v100.36,24.82 100.36,24.67 arc45 100.51,24.31 101.06,23.76 arc45 101.51,23.57 106.8,23.57 arc-45 107.07,23.46 107.85,22.69 arc45 108.12,22.57 RFE.76
  Bottom 0.203: U3.20 100.76,25.78 arc-45 100.65,25.51 100.47,25.34 arc45 100.36,25.07 v100.36,24.82
DONE_W  (via drill 0.2)
  Top 0.203: v21.56,32.33 21.56,32.48 arc45 21.41,32.84 20.86,33.39 arc45 20.41,33.58 15.12,33.58 arc-45 14.85,33.69 14.07,34.46 arc45 13.8,34.58 RFW.76
  Bottom 0.203: U2.20 21.16,31.37 arc-45 21.27,31.64 21.45,31.81 arc45 21.56,32.08 v21.56,32.33
E_EN  (via drill 0.2)
  Top 0.203: X-EAST.14 80.89,39.33 | 80.89,39.33 arc45 81.34,39.51 | 81.34,39.51 v81.91,40.07 | 80.89,39.33 arc45 81.34,39.51 | v92.08,41.91 92.57,41.91 arc-45 93.02,41.72 94.56,40.19 arc45 95,40 96.93,40 arc-90 97.56,39.37 97.56,38.92 arc45 97.75,38.47 97.87,38.34 arc-45 98.06,37.89 RFE.20
  Bottom 0.203: v81.91,40.07 82.48,40.07 arc45 82.93,40.25 83.39,40.71 arc-45 83.66,40.83 85.3,40.83 arc45 85.57,40.94 85.85,41.21 arc-45 86.12,41.33 89.94,41.33 arc45 90.2,41.44 90.49,41.72 arc-45 90.94,41.91 v92.08,41.91
E_I2C_EN  (via drill 0.2)
  Top 0.203: X-EAST.13 88.31,39.33 89.03,38.61 89.03,31.18 v89.92,30.29
  Bottom 0.203: U3.27 91.09,29.38 arc-45 90.64,29.56 v89.92,30.29
E_I2C_V  (via drill 0.2)
  Top 0.254: X-EAST.11 v84.96,39.83
  Route2 0.508: v84.96,39.83 85.49,40.35 arc45 85.67,40.8 85.67,44.14 arc-45 85.86,44.59 89.35,48.07 arc45 89.53,48.52 89.53,50.54 arc-45 89.72,50.99 PWR-NE.1
E_SCK  (via drill 0.2)
  Top 0.203: X-EAST.12 79.38,39.83 | 79.38,39.83 arc-45 78.94,40.01 | 79.38,39.83 arc-45 78.94,40.01 | 78.94,40.01 v78.87,40.08 | v97.56,35.02 RFE.21
  Route2 0.203: v91.44,42.55 91.94,42.55 arc-45 92.39,42.36 94.56,40.19 arc45 95,40 96.93,40 arc-90 97.56,39.37 97.56,38.92 arc45 97.75,38.47 97.87,38.34 arc-45 98.06,37.89 98.06,36.53 arc-45 97.95,36.26 97.67,35.99 arc45 97.56,35.72 v97.56,35.02
  Bottom 0.203: 79.18,40.39 arc-45 79.63,40.58 | v78.87,40.08 79.18,40.39 | 79.18,40.39 arc-45 79.63,40.58 | 91.42,42.53 v91.44,42.55 90.71,42.55 arc45 90.44,42.43 89.94,41.94 arc-45 89.67,41.83 84.77,41.83 arc45 84.5,41.71 84.22,41.44 arc-45 83.95,41.33 83.39,41.33 arc45 83.12,41.21 82.67,40.76 arc-45 82.22,40.58 79.63,40.58
E_SCL
  Top 0.203: 87.44,38.83 87.5,38.83 | X-EAST.15 87.44,38.83 | 87.44,38.83 arc-90 88.58,37.68 88.58,31.06 arc45 88.77,30.61 89.62,29.76 arc45 90.07,29.57 RFE.36
E_SDA
  Top 0.203: 87.28,38.33 X-EAST.17 87.5,38.33 arc-90 88.14,37.69 88.14,30.74 arc45 88.32,30.29 89.36,29.26 arc45 89.81,29.07 RFE.37
E_SDI  (via drill 0.2)
  Top 0.203: X-EAST.16 81.14,38.83 arc45 81.59,39.01 v81.91,39.33 | v91.44,41.27 92.32,41.27 arc-45 92.77,41.09 94.3,39.56 arc45 94.75,39.37 95.43,39.37 arc-90 96.06,38.73 RFE.24
  Bottom 0.203: 81.97,39.39 v81.91,39.33 85.52,39.33 86.32,40.13 87.78,40.13 arc45 88.23,40.32 88.74,40.83 90.31,40.83 90.76,41.27 v91.44,41.27
E_SDO  (via drill 0.2)
  Top 0.203: X-EAST.18 81.4,38.33 | 81.4,38.33 arc45 81.85,38.51 | 81.85,38.51 v81.91,38.58 | 81.4,38.33 arc45 81.85,38.51 | v95.56,35.02 RFE.25
  Route2 0.203: v95.56,35.02 95.56,35.72 arc-45 95.67,35.99 95.95,36.26 arc45 96.06,36.53 96.06,38.73 arc90 95.43,39.37 94.75,39.37 arc-45 94.3,39.56 93.4,40.45 arc45 92.95,40.64 v92.08,40.64
  Bottom 0.203: v92.08,40.64 90.88,40.64 90.56,40.33 89.01,40.33 88.49,39.81 arc-45 88.04,39.62 86.43,39.62 85.66,38.86 82.2,38.86 v81.91,38.58
E_SPI_V  (via drill 0.2)
  Top 0.254: X-EAST.21 84.71,37.33 arc-90 84.46,37.58 v84.46,38.1
  Route2 0.508: PWR-NE.3 92.26,50.99 arc45 92.08,50.54 92.08,48.52 arc-45 91.89,48.07 91.63,47.81 arc-45 91.18,47.62 90.75,47.62 arc45 90.3,47.44 86.86,44 arc45 86.68,43.55 86.68,40.01 arc-45 86.49,39.56 85.59,38.67 arc-45 85.14,38.48 85.1,38.48 arc45 84.65,38.3 v84.46,38.1
E_VE_CV  (via drill 0.2)
  Top 0.152: X-EAST.90 v81.46,17.32
  Bottom 0.152: PB-SE.19 84.9,16.85 arc-45 84.63,16.97 84.44,17.16 arc45 84.17,17.27 81.51,17.27 v81.46,17.32
E_VE_OV  (via drill 0.2)
  Top 0.152: X-EAST.93 87.94,15.32 arc-45 88.12,15.25 88.94,14.43 arc45 89.12,14.35 v91.69,14.35
  Bottom 0.152: PB-SE.10 v91.69,14.35
E_VE_UV  (via drill 0.2)
  Top 0.152: X-EAST.91 88.08,15.82 arc-45 88.26,15.75 89.08,14.93 arc45 89.26,14.85 v91.31,14.85
  Bottom 0.152: PB-SE.12 v91.31,14.85
GND  (via drill 0.2, 0.33, 0.41, 0.64, 2.15 pad 2.3, 3.17 pad 4.5)
  Top 0.152: v109.23,42.46 HDR-NE.2 | v109.23,47.46 HDR-NE.1
  Bottom 0.152: HDR-NE.1 v109.23,47.46 | v19.56,29.38 18.66,30.27 | v21.16,29.38 22.06,30.27 | 22.06,26.88 v21.16,27.77 U2.29 | v19.56,27.77 18.66,26.88 | 99.86,30.27 v100.76,29.38 U3.29 | v102.36,29.38 103.26,30.27 | v102.36,27.77 103.26,26.88 | v100.76,27.77 99.86,26.88